# EAGLE design deadlock-reader (EAGLE 7.4.0)
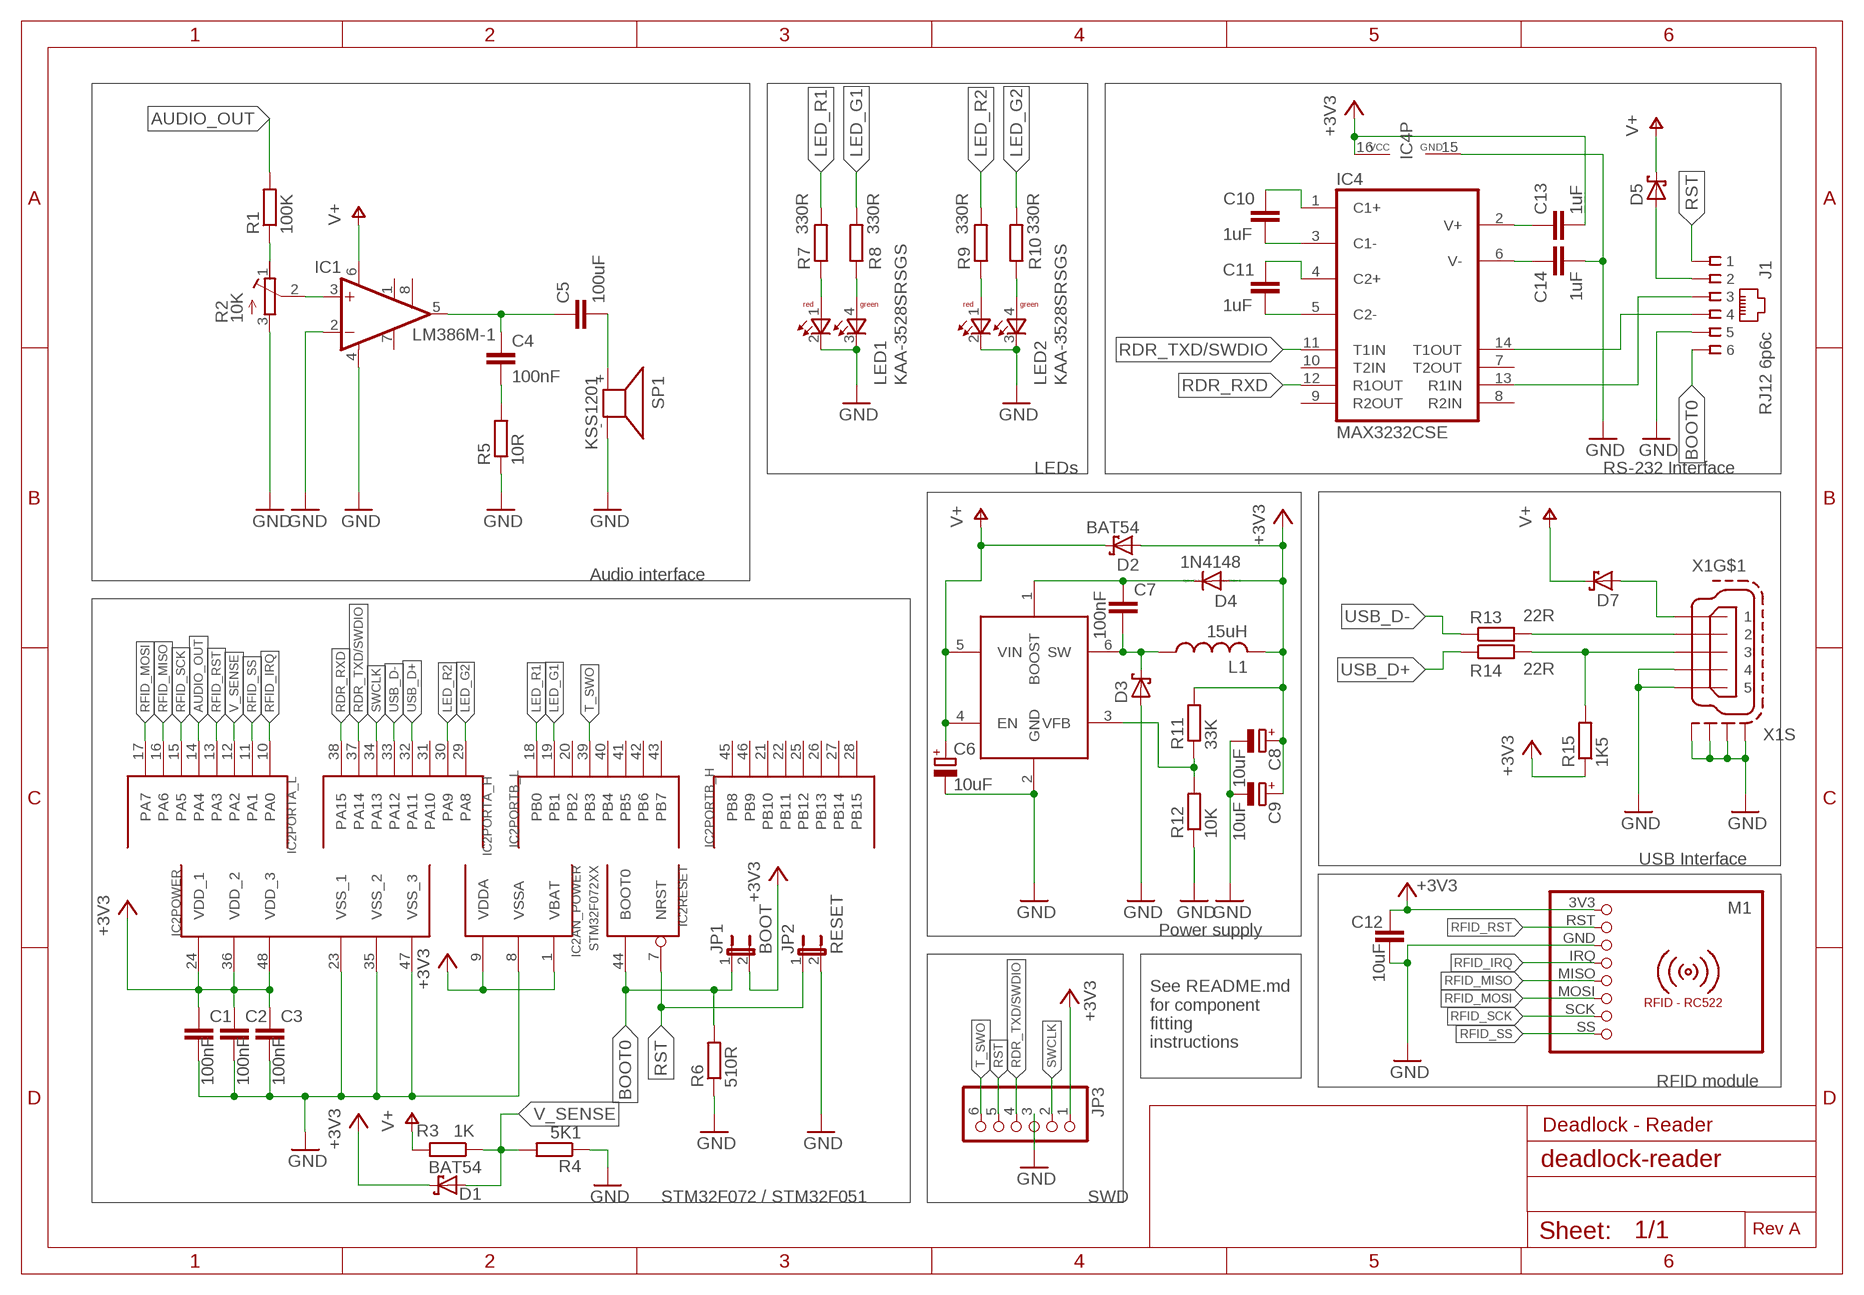
[diagram p0: schematic, sheet 1]

## Parts
C1  100nF  C-EUC0805  [C0805]
C2  100nF  C-EUC0805  [C0805]
C3  100nF  C-EUC0805  [C0805]
C4  100nF  C-EUC0805  [C0805]
C5  100uF  C-EUC1206  [C1206]
C6  10uF  CPOL-EUSMCD  [SMC_D]
C7  100nF  C-EUC0805  [C0805]
C8  10uF  CPOL-EUA/3216-18R  [A/3216-18R]
C9  10uF  CPOL-EUA/3216-18R  [A/3216-18R]
C10  1uF  C-EUC0805  [C0805]
C11  1uF  C-EUC0805  [C0805]
C12  10uF  C-EUC0805  [C0805]
C13  1uF  C-EUC0805  [C0805]
C14  1uF  C-EUC0805  [C0805]
D1  BAT54  [SOT23]
D2  BAT54  [SOT23]
D3  BAT60J  [SOD323_ST]
D4  1N4148  DIODE-SOD323-W  [SOD323-W]
D5  BAT60J  [SOD323_ST]
D7  BAT60J  [SOD323_ST]
IC1  LM386M-1  [SO08]
IC2  STM32F072XX  [TQFP48]
IC3  MCP16301/H  [SOT23-6]
IC4  MAX3232CSE  [SO16]
J1  RJ12 6p6c  RJ11-2X  [RJ11-NO_SHIELD]
JP1  BOOT  JP1E  [JP1]
JP2  RESET  JP1E  [JP1]
JP3  PINHD-1X6  [1X06]
L1  15uH  L-USPIS2816  [PIS2816]
LED1  KAA-3528SRSGS  [KAA-3528SRSGS]
LED2  KAA-3528SRSGS  [KAA-3528SRSGS]
M1  RFID-RC522  [RFID-RC522]
R1  100K  R-EU_M0805  [M0805]
R2  10K  R-TRIMM3314G  [RTRIM3314G]
R3  1K  R-EU_R0805  [R0805]
R4  5K1  R-EU_R0805  [R0805]
R5  10R  R-EU_R0805  [R0805]
R6  510R  R-EU_R0805  [R0805]
R7  330R  R-EU_R0805  [R0805]
R8  330R  R-EU_R0805  [R0805]
R9  330R  R-EU_R0805  [R0805]
R10  330R  R-EU_R0805  [R0805]
R11  33K  R-EU_R0805  [R0805]
R12  10K  R-EU_R0805  [R0805]
R13  22R  R-EU_R0805  [R0805]
R14  22R  R-EU_R0805  [R0805]
R15  1K5  R-EU_R0805  [R0805]
SP1  KSS1201  [KSS1201]
X1  MINI-USB-SCHIELD-32005-301  [32005-301]

## Nets
+3V3: C1.1 C2.1 C3.1 C8.+ C9.+ C12.1 C13.2 D1.3(C) D2.1(A) D4.A IC2.1(AN_POWER:VBAT) IC2.9(AN_POWER:VDDA) IC2.24(POWER:VDD_1) IC2.36(POWER:VDD_2) IC2.48(POWER:VDD_3) IC4.16(VCC) JP1.2 JP3.1 L1.2 M1.3V3 R11.2 R15.1
AUDIO_OUT: IC2.14(PORTA_L:PA4) R1.2
BOOT0: IC2.44(RESET:BOOT0) J1.6 JP1.1 R6.2
GND: C1.2 C2.2 C3.2 C6.- C8.- C9.- C12.2 C14.2 D3.A IC1.2(-IN) IC1.4(GND) IC2.8(AN_POWER:VSSA) IC2.23(POWER:VSS_1) IC2.35(POWER:VSS_2) IC2.47(POWER:VSS_3) IC3.2(GND) IC4.15(GND) J1.5 JP2.2 JP3.3 LED1.2(C-RED) LED1.3(C-GREEN) LED2.2(C-RED) LED2.3(C-GREEN) M1.GND R2.3(A) R4.1 R5.1 R6.1 R12.1 SP1.- X1.4 X1.5 X1.M1(S:S1) X1.M2(S:S2) X1.M3(S:S3) X1.M4(S:S4)
LED_G1: IC2.19(PORTB_L:PB1) R8.2
LED_G2: IC2.29(PORTA_H:PA8) R10.2
LED_R1: IC2.18(PORTB_L:PB0) R7.2
LED_R2: IC2.30(PORTA_H:PA9) R9.2
N$1: IC4.13(R1IN) J1.3
N$2: IC4.14(T1OUT) J1.4
N$3: C10.1 IC4.1(C1+)
N$4: C10.2 IC4.3(C1-)
N$5: C11.1 IC4.4(C2+)
N$6: C11.2 IC4.5(C2-)
N$7: C13.1 IC4.2(V+)
N$8: C14.1 IC4.6(V-)
N$9: D5.A J1.2
N$10: LED2.1(A-RED) R9.1
N$11: D7.A X1.1
N$12: R13.2 X1.2
N$13: R14.2 R15.2 X1.3
N$14: R1.1 R2.1(E)
N$15: IC1.3(+IN) R2.2(S)
N$16: C4.1 C5.1 IC1.5(OUT)
N$17: C4.2 R5.2
N$18: C5.2 SP1.+
N$19: LED1.1(A-RED) R7.1
N$20: LED1.4(A-GREEN) R8.1
N$21: LED2.4(A-GREEN) R10.1
N$22: C7.2 D3.C IC3.6(SW) L1.1
N$23: C7.1 D4.C IC3.1(BOOST)
N$25: IC3.3(VFB) R11.1 R12.2
RDR_RXD: IC2.38(PORTA_H:PA15) IC4.12(R1OUT)
RDR_TXD/SWDIO: IC2.37(PORTA_H:PA14) IC4.11(T1IN) JP3.4
RFID_IRQ: IC2.10(PORTA_L:PA0) M1.IRQ
RFID_MISO: IC2.16(PORTA_L:PA6) M1.MISO
RFID_MOSI: IC2.17(PORTA_L:PA7) M1.MOSI
RFID_RST: IC2.13(PORTA_L:PA3) M1.RST
RFID_SCK: IC2.15(PORTA_L:PA5) M1.SCK
RFID_SS: IC2.11(PORTA_L:PA1) M1.SS
RST: IC2.7(RESET:NRST) J1.1 JP2.1 JP3.5
SWCLK: IC2.34(PORTA_H:PA13) JP3.2
T_SWO: IC2.39(PORTB_L:PB3) JP3.6
USB_D+: IC2.32(PORTA_H:PA11) R14.1
USB_D-: IC2.33(PORTA_H:PA12) R13.1
V+: C6.+ D2.3(C) D5.C D7.C IC1.6(VS) IC3.4(EN) IC3.5(VIN) R3.2
V_SENSE: D1.1(A) IC2.12(PORTA_L:PA2) R3.1 R4.2
Unconnected: IC1.1(GAIN) IC1.7(BYPASS) IC1.8(GAIN) IC2.2(PORTC:PC13) IC2.3(PORTC:PC14) IC2.4(PORTC:PC15) IC2.5(PORTF/OSC:PF0/OSC<=) IC2.6(PORTF/OSC:PF1/OSC=>) IC2.20(PORTB_L:PB2) IC2.21(PORTB_H:PB10) IC2.22(PORTB_H:PB11) IC2.25(PORTB_H:PB12) IC2.26(PORTB_H:PB13) IC2.27(PORTB_H:PB14) IC2.28(PORTB_H:PB15) IC2.31(PORTA_H:PA10) IC2.40(PORTB_L:PB4) IC2.41(PORTB_L:PB5) IC2.42(PORTB_L:PB6) IC2.43(PORTB_L:PB7) IC2.45(PORTB_H:PB8) IC2.46(PORTB_H:PB9) IC4.7(T2OUT) IC4.8(R2IN) IC4.9(R2OUT) IC4.10(T2IN)

## Notes on the sheet
- LEDs | RS-232 Interface
- Audio interface
- USB Interface
- Power supply
- See README.md
  for component
  fitting
  instructions
- RFID module
- Deadlock - Reader
- STM32F072 / STM32F051 | SWD
- Rev A

## Library data of the parts
C1-C5 C7 C10-C14 = rcl:C-EU: CAPACITOR, European symbol
C6 C8 C9 = rcl:CPOL-EU: POLARIZED CAPACITOR, European symbol
D1 D2 = diode:BAT54: Schottky Diodes Source: Fairchild .. BAT54.pdf
D3 D5 D7 = diode:BAT60J: Schottky barrier diode Source: www.st.com, BAT60J.pdf
D4 = diode:DIODE-: DIODE
IC1 = linear:LM386?-*: Low Voltage Audio Power Amplifier Source: http://cache.national.com/ds/LM/LM386.pdf
IC2 = stm32f051:STM32F072XX: ST STM32F072 48pin LQFP
IC3 = MCP16301:MCP16301/H: High-Voltage Input Integrated Switch Step-Down Regulator
IC4 = maxim:MAX3232*: True RS-232 Transceivers 3.0V to 5.5V, Low-Power up to 1Mbps, Using Four 0.1µF External Capacitors Source: http://pdfserv.maxim-ic.com/en/ds/MAX3222-MAX3241.pdf; MPN: MAX3232CSE; OC_FARNELL: 9725490; OC_NEWARK: 90C2890
J1 = con-tycoelectronics:RJ11: CORCOM Modular RJ Jacks No Shield Source: www.tycoelectronics.com .. ENG_DS_1654001_1099_RJ_L_0507.pdf; OC_FARNELL: unknown; OC_NEWARK: unknown
JP1 JP2 = jumper:JP1E: JUMPER
JP3 = pinhead:PINHD-1X6: PIN HEADER
L1 = rcl:L-US: INDUCTOR, American symbol
LED1 LED2 = kaa-3528:KAA-3528SRSGS: KINGBRIGHT ELECTRONIC KAA-3528RSGS
M1 = mfrc522-module:RFID-RC522: RFID-RC522 MFRC-522 based breakout board
R1 = resistor:R-EU_: RESISTOR, European symbol
R2 = resistor:R-TRIMM: Trimm resistor
R3-R15 = rcl:R-EU_: RESISTOR, European symbol
SP1 = buzzer:KSS1201: SPEAKER Source: Schukat; OC_FARNELL: unknown; OC_NEWARK: unknown
X1 = con-cypressindustries:MINI-USB-SCHIELD-: MINI USB-B Conector Source: www.cypressindustries.com; OC_FARNELL: unknown; OC_NEWARK: unknown

## Board
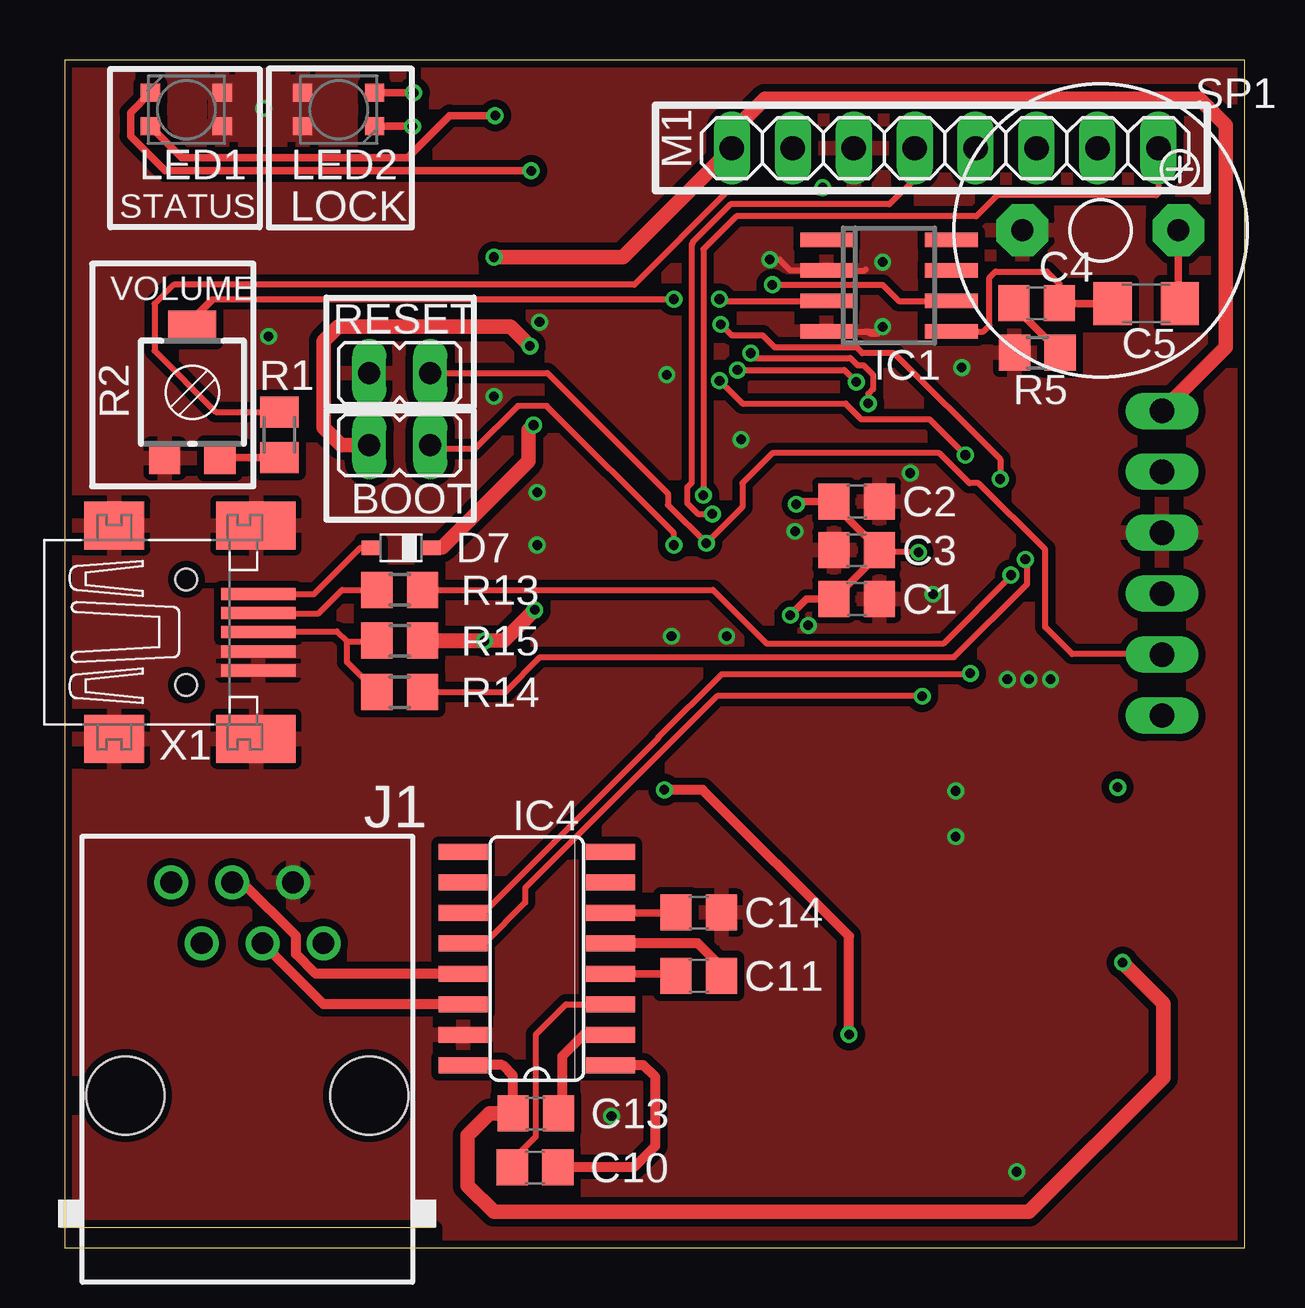
[diagram p1: board, top side]
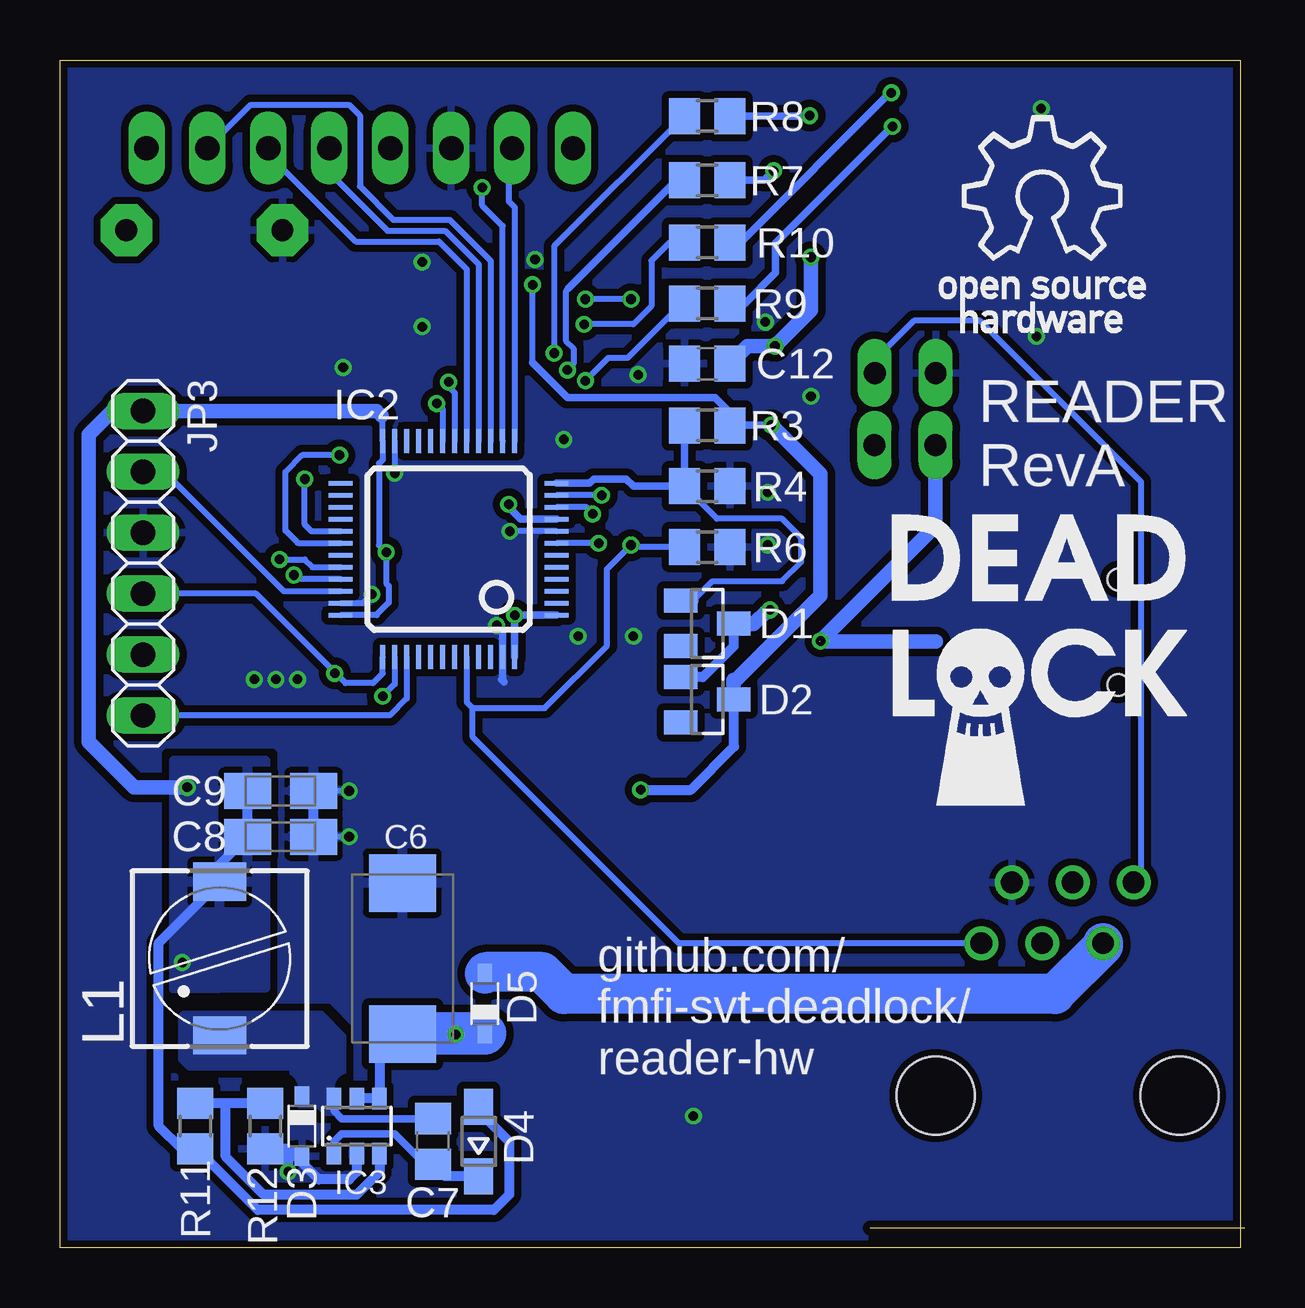
[diagram p2: board, bottom side, seen from below]

Size 49.2 x 49.52 mm. Coordinates in mm from the lower left corner, seen from the top.
Outline: 0,0 49.2,0 49.2,49.52 0,49.52 0,0
Copper layers (1*16): Top 0.035mm / dielectric 1.5mm / Bottom 0.035mm
Design rules "ITead_rule *": minimum track width 6mil, minimum drill 12mil, track to track 6mil, track to pad 6mil, pad to pad 6mil, via to via 6mil, smd to smd 0mil, copper to edge 10mil, drill to drill 10mil, minimum pad ring 10mil, minimum via ring 6mil, stop-mask expansion 2mil, vias tented up to drill 100mil, thermal gap 10mil

### Footprints (pad centres in the part's own frame; a part is rotated, then mirrored left to right if it is on the bottom)
C0805 = smd 1.3 x 1.5: 1 -0.95,0; 2 0.95,0
C1206 = smd 1.6 x 1.8: 1 -1.4,0; 2 1.4,0
SMC_D = smd 2.4 x 2.8: + -3.15,0; - 3.15,0
A/3216-18R = smd 1.95 x 1.5: + 1.375,0; - -1.375,0
SOT23 = smd 1 x 1.4: 1 -0.95,-1.1; 2 0.95,-1.1; 3 0,1.1
SOD323_ST = smd 0.8 x 0.6: A 1.25,0; C -1.25,0
SOD323-W = smd 1.5 x 1.2: A 1.45,0; C -1.45,0
SO08 = smd 0.6 x 2.2: 1 -1.905,-2.6; 2 -0.635,-2.6; 3 0.635,-2.6; 4 1.905,-2.6; 5 1.905,2.6; 6 0.635,2.6; 7 -0.635,2.6; 8 -1.905,2.6
TQFP48 = smd 0.2 x 1: 1 -2.75,-4.5; 2 -2.25,-4.5; 3 -1.75,-4.5; 4 -1.25,-4.5; 5 -0.75,-4.5; 6 -0.25,-4.5; 7 0.25,-4.5; 8 0.75,-4.5; 9 1.25,-4.5; 10 1.75,-4.5; 11 2.25,-4.5; 12 2.75,-4.5; 25 2.75,4.5; 26 2.25,4.5; 27 1.75,4.5; 28 1.25,4.5; 29 0.75,4.5; 30 0.25,4.5; 31 -0.25,4.5; 32 -0.75,4.5; 33 -1.25,4.5; 34 -1.75,4.5; 35 -2.25,4.5; 36 -2.75,4.5 | smd 1 x 0.2: 13 4.5,-2.75; 14 4.5,-2.25; 15 4.5,-1.75; 16 4.5,-1.25; 17 4.5,-0.75; 18 4.5,-0.25; 19 4.5,0.25; 20 4.5,0.75; 21 4.5,1.25; 22 4.5,1.75; 23 4.5,2.25; 24 4.5,2.75; 37 -4.5,2.75; 38 -4.5,2.25; 39 -4.5,1.75; 40 -4.5,1.25; 41 -4.5,0.75; 42 -4.5,0.25; 43 -4.5,-0.25; 44 -4.5,-0.75; 45 -4.5,-1.25; 46 -4.5,-1.75; 47 -4.5,-2.25; 48 -4.5,-2.75
SOT23-6 = smd 0.6 x 0.9: 1 -0.95,-1.15; 2 0,-1.15; 3 0.95,-1.15; 4 0.95,1.15; 5 0,1.15; 6 -0.95,1.15
SO16 = smd 0.66 x 2.032: 1 -4.445,-3.073; 2 -3.175,-3.073; 3 -1.905,-3.073; 4 -0.635,-3.073; 5 0.635,-3.073; 6 1.905,-3.073; 7 3.175,-3.073; 8 4.445,-3.073; 9 4.445,3.073; 10 3.175,3.073; 11 1.905,3.073; 12 0.635,3.073; 13 -0.635,3.073; 14 -1.905,3.073; 15 -3.175,3.073; 16 -4.445,3.073
RJ11-NO_SHIELD = drill 0.9 pad 1.4: 1 -3.175,8.89; 2 -1.905,6.35; 3 -0.635,8.89; 4 0.635,6.35; 5 1.905,8.89; 6 3.175,6.35 | hole 3.251: -5.08,0; 5.08,0
JP1 = drill 0.914 long: 1 0,-1.27; 2 0,1.27
1X06 = drill 1.016 long: 1 -6.35,0; 2 -3.81,0; 3 -1.27,0; 4 1.27,0; 5 3.81,0; 6 6.35,0
PIS2816 = smd 2.2 x 1.6: 1 0,3.2; 2 0,-3.2
KAA-3528SRSGS = smd 0.8 x 0.75: 1 1.5,-0.7; 2 -1.5,-0.7; 3 -1.5,0.7; 4 1.5,0.7
RFID-RC522 = drill 1.016 long: 3V3 -8.89,0; GND -3.81,0; IRQ -1.27,0; MISO 1.27,0; MOSI 3.81,0; RST -6.35,0; SCK 6.35,0; SS 8.89,0
M0805 = smd 1.3 x 1.6: 1 -0.95,0; 2 0.95,0
RTRIM3314G = smd 1.3 x 1.3: 1 1.15,-2.75; 3 -1.15,-2.75 | smd 2 x 1.3: 2 0,2.75
R0805 = smd 1.3 x 1.5: 1 -0.95,0; 2 0.95,0
KSS1201 = drill 0.914 pad 2.159 octagon: + 3.251,0; - -3.251,0
32005-301 = smd 3.1 x 0.5: 1 3,1.6; 2 3,0.8; 3 3,0; 4 3,-0.8; 5 3,-1.6 | smd 2.5 x 2: M1 -3,-4.45; M2 -3,4.45 | smd 3.3 x 2: M3 2.9,4.45; M4 2.9,-4.45 | hole 0.9: 0,2.2; 0,-2.2

### Placement (x,y rotation side)
C1  33.02,27.05 0 top
C2  33.02,31.11 0 top
C3  33.02,29.09 180 top
C4  40.52,39.38 180 top
C5  45.09,39.37 0 top
C6  34.92,12.06 90 bottom
C7  33.66,4.45 90 bottom
C8  40.01,17.14 180 bottom
C9  40.01,19.05 180 bottom
C10  19.61,3.36 180 top
C11  26.43,11.34 0 top
C12  22.23,36.86 180 bottom
C13  19.64,5.61 180 top
C14  26.43,13.98 0 top
D1  22.23,26.04 270 bottom
D2  22.23,22.86 270 bottom
D3  39.12,5.08 270 bottom
D4  31.75,4.45 90 bottom
D5  31.49,10.19 90 bottom
D7  14.03,29.19 180 top
IC1  34.37,40.11 270 top
IC2  33,29.12 90 bottom
IC3  36.83,5.08 0 bottom
IC4  19.68,12.06 90 top
J1  7.62,6.35 0 top
JP1  13.97,33.47 90 top
JP2  13.97,36.48 90 top
JP3  45.74,28.55 270 bottom
L1  42.55,12.06 180 bottom
LED1  5.08,47.45 180 top
LED2  11.43,47.45 0 top
M1  36.7,45.84 0 top
R1  8.96,33.9 90 top
R2  5.33,35.67 0 top
R3  22.23,34.29 0 bottom
R4  22.23,31.75 180 bottom
R5  40.55,37.32 0 top
R6  22.23,29.21 180 bottom
R7  22.23,44.5 180 bottom
R8  22.23,47.18 180 bottom
R9  22.23,39.37 180 bottom
R10  22.23,41.91 180 bottom
R11  43.56,5.08 270 bottom
R12  40.64,5.08 90 bottom
R13  13.97,27.43 180 top
R14  13.97,23.18 180 top
R15  13.97,25.32 180 top
SP1  43.18,42.42 0 top
X1  5.08,25.67 0 top

### Tracks (layer width: path | path; a pad name or v marks a point on that pad's centre or on a via)
+3V3  (via drill 0.4)  (1 unrouted)
  Top 0.254: v35.6,29 34.05,29 C3.1
  Top 0.305: v30.5,31 30.61,31.11 C2.1 32.07,30.98 C3.1 33.97,28.95 C1.1 30.93,27.05 v30.25,26.38
  Top 0.406: C13.2 18.69,7.18 18.25,7.62 IC4.16
  Top 0.61: C13.2 17.71,5.61 16.8,4.7 16.8,2.6 17.9,1.5 40.2,1.5 45.8,7.1 45.8,10.2 v44.1,11.9 | v19.4,37.6 18.6,38.4 11.4,38.4 10.8,37.8 10.8,34.2 11.53,33.47 JP1.2 | v17.5,25.3 14.94,25.3 R15.1 18.32,25.32 v19.6,26.6 | v17.9,41.3 23.27,41.3 M1.3V3 27.8,45.86 27.8,46.5 29.2,47.9 47.3,47.9 48.4,46.8 48.4,37.55 JP3.1
  Bottom 0.254: 35.8,34.7 35.75,34.65 IC2.24 35.75,32.85 35.9,32.7 35.9,29.3 v35.6,29 35.6,27.7 35.5,27.6 35.5,26.9 36,26.4 36,26.38 IC2.36
  Bottom 0.305: v30.5,31 30.5,30.88 30,30.38 IC2.9 | IC2.1 v30.25,26.38 IC2.48
  Bottom 0.406: C9.+ C8.+ 42.55,15.98 L1.2 45.09,12.72 45.09,5.08 44.13,4.13 R11.2 43.5,4.13 40.96,1.59 31.11,1.59 30.48,2.22 30.48,4.45 31.75,5.71 D4.A | D1.3 21.12,25.07 22.4,23.8 23.32,23.8 D2.1
  Bottom 0.61: C12.1 20.54,37.6 v19.4,37.6 17.9,39.1 v17.9,41.3 | v19.6,26.6 19.7,26.6 20.3,26 21.09,26 D1.3 | v43.9,19.2 46.1,19.2 48,21.1 48,33.9 47,34.9 46.99,34.9 JP3.1 35.99,34.9 35.8,34.7 | 12.7,25.27 17.53,25.27 12.7,30.1 JP1.2
  pour Bottom (isolate 0.406): 40.64,20.32 40.64,10.85 44.45,10.79 44.45,20.32
AUDIO_OUT  (via drill 0.4)
  Top 0.254: v31.6,44.2 31.4,44 27.6,44 23.75,40.15 4.55,40.15 3.75,39.35 3.75,37.4 6.3,34.84 R1.2
  Bottom 0.254: IC2.14 30.75,42.6 31.6,43.45 v31.6,44.2
BOOT0  (via drill 0.4)
  Top 0.254: v25.4,29.3 25.4,29.8 20.1,35.1 18.9,35.1 17.1,33.3 15.41,33.3 JP1.1
  Bottom 0.254: IC2.44 32.25,22.75 32,22.5 | 32,22.5 29,22.5 26.4,25.1 26.4,28.3 v25.4,29.3 25.31,29.21 R6.2 | J1.6 23.4,12.7 32,21.3 32,22.5
GND  (via drill 0.4)
  Top 0.254: IC1.4 33.8,38.2 33.9,38.1 33.6,38.1 33.5,38.2 33.4,38.2 | 33.4,40.8 33.34,40.74 IC1.2 30.25,40.74 29.8,41.2 v29.4,41.2
  Top 0.305: C2.2 33.97,30.98 | C3.2 32.07,28.95
  Bottom 0.254: v37.15,19.05 C9.- | v37.15,17.14 C8.- | IC2.23 v35.25,32.3 | IC2.35 36.58,26.88 v36.2,27.25 | IC2.47 30.75,25.75 30.95,25.95 v31,25.95 | IC2.8 v30.45,29.88
  Bottom 0.305: 30.75,25.75 30.75,23.75 30.8,23.7 30.7,23.6
  Bottom 0.406: C8.- C9.- | IC3.2 36.83,3.17 37.15,2.86 38.42,2.86 39.69,4.13 | 39.69,4.13 R12.1 | 39.69,4.13 v39.69,3.18 v39.69,3.17
  other vias: 25.1,36.4 28.2,33.7 17.9,35.5 22.8,5.5 25.3,25.5 27.6,25.5 8.5,38 8.3,47.5 19.8,38.6 19.7,31.5 19.7,29.3 40.2,23.7 41.1,23.7 39.3,23.7 37.4,36.7 34.1,41.1 34.1,38.4
  pour Bottom (isolate 0.406, rank 6): 39.51,20.32 39.51,10.85 33.02,10.79 33.02,20.32
  pour Top (isolate 0.254): 29.62,32.12 30,32.5 36,32.5 36.38,32.12 36.38,26 36.12,25.75 29.88,25.75 29.62,26
  pour Top (no thermals): 6.13,48.25 6,48.75 10.5,48.75 10.5,46.25 6,46.25 6.13,46.5
  pour Top (isolate 0.305): 0,49.5 49.2,49.5 49.2,0 0,0
  pour Bottom (isolate 0.305, rank 6): 0,49.5 49.2,49.5 49.2,0 0,0
LED_G1  (via drill 0.4)
  Top 0.254: v28.6,37.3 28.8,37.1 32.75,37.1 33.05,36.8 33.3,36.8 33.7,36.4 33.7,35.8 33.5,35.6 v33.5,35.2
  Bottom 0.254: R8.2 28.6,41.76 v28.6,37.3 | v33.5,35.2 33.25,34.95 IC2.19
LED_G2  (via drill 0.4)
  Top 0.254: v27.35,38.5 27.8,38.05 29.1,38.05 29.6,37.55 33,37.55 33.25,37.3 34.58,37.3 39,32.88 v39,32.05
  Bottom 0.254: v27.35,38.5 25.3,38.5 24.55,39.25 24.55,41.15 23.79,41.91 R10.2 | IC2.29 38.73,29.88 39,30.15 v39,32.05
LED_R1  (via drill 0.4)
  Top 0.254: v28.05,36.6 32.5,36.6 v33,36.1
  Bottom 0.254: R7.2 23.55,44.5 | v33,36.1 33,35.9 32.75,35.65 IC2.18 | 27.85,36.8 v28.05,36.6 27.8,36.85 27.8,37.5 28.1,37.8 28.1,39.9 28,40
  Bottom 0.305: 28,40 23.5,44.5 R7.2
LED_R2  (via drill 0.4)
  Top 0.254: v37.55,33.05 36.05,34.55 33.2,34.55 32.55,35.2 28.25,35.2 v27.3,36.15
  Bottom 0.254: R9.2 23.28,39.37 25.55,37.1 26.35,37.1 v27.3,36.15 | IC2.30 39.25,29.38 39.27,29.4 39.3,29.4 39.8,29.9 39.8,32.35 39.1,33.05 v37.55,33.05
N$1
  Top 0.406: IC4.13 10.47,11.43 9.65,12.25 9.65,13 7.41,15.24 J1.3
N$2
  Top 0.406: IC4.14 10.79,10.16 J1.4
N$3
  Top 0.406: C10.1 20.57,3.38 23.75,3.38 24.62,4.25 24.62,7.12 24.13,7.62 IC4.1
N$4
  Top 0.254: C10.2 18.66,3.66 19.65,4.65 19.65,8.9 20.91,10.16 IC4.3
  Top 0.406: 22.75,10.15 IC4.3
N$5
  Top 0.305: 23.57,11.43 25.39,11.43 C11.1
  Top 0.406: IC4.4 23.57,11.43
N$6
  Top 0.254: 27.66,11.44 27.56,11.34 C11.2
  Top 0.406: 27.66,11.44 26.4,12.7 IC4.5
N$7
  Top 0.406: C13.1 20.75,5.77 20.75,8 21.64,8.89 IC4.2
N$8
  Top 0.305: IC4.6 C14.1
N$9
  Bottom 1.676: D5.A 31.45,11.48 31.45,11.5 29.1,11.5 28.19,10.59 7.72,10.59 5.71,12.6 J1.2
N$10  (via drill 0.4)
  Top 0.305: LED2.1 v14.5,46.75
  Bottom 0.305: v14.5,46.75 19.38,41.88 19.38,40.65 20.66,39.37 R9.1
N$11
  Top 0.254: X1.1 8.1,27.25 10.4,27.25 12.34,29.19 D7.A
N$12
  Top 0.254: X1.2 8.1,26.45 10.6,26.45 11.58,27.43 R13.2
N$13
  Top 0.254: X1.3 8.11,25.7 11.35,25.7 11.78,25.27 | 11.78,25.27 12.97,25.27 R15.2 | R14.2 11.78,24.42 11.78,25.27
N$14
  Top 0.305: R2.1 6.5,32.95 R1.1
N$15  (via drill 0.4)
  Top 0.254: 6.12,39.5 6.17,39.55 v25.4,39.55 | v27.3,39.55 27.38,39.48 IC1.3
  Top 0.305: 6.12,39.5 5.33,38.7 R2.2
  Bottom 0.254: v25.4,39.55 v27.3,39.55
N$16
  Top 0.254: IC1.5 38.3,38.2 38.55,38.45 38.55,40.45 38.8,40.7 40.95,40.7 41.47,40.18 C4.1
  Top 0.305: C5.1 C4.1
N$17
  Top 0.305: C4.2 39.57,39.25 R5.2
N$18
  Top 0.254: 46.43,39.42 C5.2
  Top 0.305: 46.43,39.42 SP1.+
N$19  (via drill 0.4)
  Top 0.305: LED1.1 2.75,47.32 2.75,46.35 4.2,44.9 v19.45,44.9
  Bottom 0.305: v19.45,44.9 19.85,44.5 R7.1
N$20  (via drill 0.4)
  Top 0.305: LED1.4 4.88,45.45 14.3,45.45 16.05,47.2 v17.95,47.2
  Bottom 0.305: v17.95,47.2 17.97,47.18 R8.1
N$21  (via drill 0.4)
  Top 0.305: LED2.4 v14.55,48.15
  Bottom 0.305: v14.55,48.15 14.6,48.15 20.84,41.91 R10.1
N$22
  Bottom 0.305: C7.2 37.46,5.39 37.78,5.71 IC3.6
  pour Bottom (isolate 0.61, no thermals): 37.47,6.03 37.47,8.81 38.32,9.69 44.03,9.69 44.45,9.21 44.45,8.26 43.81,7.62 39.43,7.62 39.43,6.03 38.42,6.03 38.1,5.71 37.78,5.71
N$23
  Bottom 0.305: 33.98,3.5 35.24,4.76 37.47,4.76 37.78,4.45 IC3.1
  Bottom 0.406: D4.C 33.16,3 C7.1 33.98,3.5 | IC3.1
N$25
  Bottom 0.406: R12.2 42.29,6.03 | 42.29,6.03 R11.1 | IC3.3 35.88,3.17 36.83,2.22 40.7,2.22 42.29,3.81 42.29,6.03
RDR_RXD  (via drill 0.4)
  Top 0.254: v35.75,23 27.2,23 19.2,15 19.2,14.4 17.5,12.7 IC4.12
  Bottom 0.254: IC2.38 35.25,23.5 v35.75,23
RDR_TXD/SWDIO  (via drill 0.4)
  Top 0.254: 17.47,13.97 24.75,21.25 24.73,21.25 27.4,23.93 37.73,23.93 v37.75,23.95
  Top 0.305: IC4.11 17.47,13.97
  Bottom 0.254: IC2.37 35.75,23.95 36.15,23.55 37.3,23.55 37.7,23.95 | 37.7,23.95 41.02,27.27 JP3.4 | 37.7,23.95 v37.75,23.95
RFID_IRQ  (via drill 0.4)
  Top 0.254: v27,30.6 26.4,30.6 25.95,31.05 25.95,31.7 26.15,31.9 26.15,41.85 26.18,41.88 26.18,41.92 27.75,43.5 34.38,43.5 35.44,44.56 M1.IRQ
  Bottom 0.254: v27,30.6 27,30.62 27.25,30.88 IC2.10
RFID_MISO
  Bottom 0.254: IC2.16 31.75,41 33.15,42.4 35.55,42.4 37.95,44.8 37.95,45.82 M1.MISO
RFID_MOSI
  Bottom 0.254: IC2.17 32.25,40.8 33.4,41.95 36.87,41.95 40.52,45.59 M1.MOSI
RFID_RST
  Bottom 0.254: M1.RST 30.5,45.7 30.5,43.62 30.25,43.38 IC2.13
RFID_SCK
  Bottom 0.254: IC2.15 31.25,41.15 32.95,42.85 35.3,42.85 36.7,44.25 36.7,47.2 37.15,47.65 41.25,47.65 M1.SCK
RFID_SS  (via drill 0.4)
  Top 0.254: v26.62,31.38 26.62,41.62 28,43 38,43 38.88,43.88 45.5,43.88 45.59,43.97 M1.SS
  Bottom 0.254: v26.62,31.38 IC2.11
RST  (via drill 0.4)
  Top 0.254: JP3.5 45.73,24.75 42,24.75 40.88,25.88 40.88,29.12 40.85,29.12 38.1,31.88 37.72,31.88 36.48,33.12 29.5,33.12 28.25,31.88 28.25,30.88 v26.75,29.38 25.15,30.98 25.15,31.45 20.12,36.48 JP2.1
  Bottom 0.254: v26.75,29.38 IC2.7 | JP2.1 15.1,36.62 15.1,37.15 13.6,38.65 10.85,38.65 4.14,31.95 4.14,15.54 J1.1
SWCLK
  Bottom 0.254: JP3.2 44.85,32.35 39.88,27.38 IC2.34
T_SWO
  Bottom 0.254: IC2.39 34.75,22.9 35.45,22.2 JP3.6
USB_D+  (via drill 0.4)
  Top 0.254: v40.05,28.7 40.12,28.62 40.12,27.68 37.08,24.62 19.82,24.62 18.38,23.18 R14.1
  Bottom 0.254: v40.05,28.7 39,28.7 38.67,28.38 IC2.32
USB_D-  (via drill 0.4)
  Top 0.254: R13.1 27.02,27.43 29.25,25.2 36.65,25.2 39.45,28 v39.45,28.05
  Bottom 0.254: 39.38,27.98 v39.45,28.05 39.27,27.88 IC2.33
V+  (via drill 0.4)
  Top 0.254: v29.5,40.15 34.1,40.15 34.77,39.48 IC1.6
  Top 0.305: D7.C 15.74,29.19
  Top 0.406: v32.7,8.9 32.7,13 26.6,19.1 v25,19.1
  Top 0.61: 15.74,29.19 19.35,32.8 19.35,34.1 v19.55,34.3
  Bottom 0.254: 29.5,36.9 v29.5,40.15
  Bottom 0.305: v19.55,34.3 21.27,34.3 R3.2 21.27,34.83 21.9,35.45 28.05,35.45 29.5,36.9 | v32.7,8.9 31.53,8.9 D5.C
  Bottom 0.406: C6.+ 35.88,7.96 IC3.4 IC3.5 | v25,19.1 22.9,19.1 21.1,20.9 21.1,22.84 D2.3
  Bottom 0.61: D2.3 21.12,23.68 21.02,23.68 17.5,27.2 17.5,32.25 v19.55,34.3
  Bottom 1.422: 34.9,8.89 C6.+
  Bottom 1.778: D5.C 34.9,8.94 C6.+
V_SENSE
  Bottom 0.254: R4.2 21.82,30.4 19.1,30.4 18.3,29.6 18.3,28.6 19.1,27.8 22,27.8 22.73,27.07 22.73,26.98
  Bottom 0.305: R3.1 R4.2 25.3,31.75 25.6,32.05 26.95,32.05 27.12,31.88 IC2.12 | D1.1 22.73,26.98

### Text on the board
bPlace: READER / RevA | github.com/ / fmfi-svt-deadlock/ / reader-hw
tNames: STATUS | LOCK | VOLUME | RESET | BOOT